# EAGLE schematic 4-Fach-Anzeige (EAGLE 7.2.0)
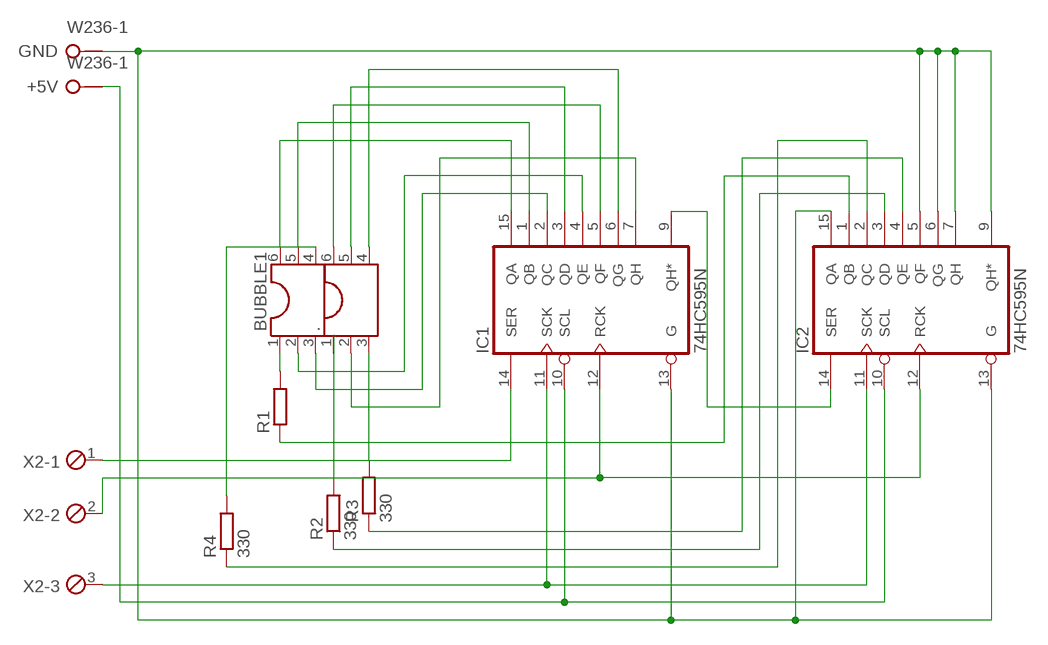
[diagram p0: schematic, sheet 1]

## Parts
+5V  W236-1  [W236-1]
.  DIL6  [DIL06]
BUBBLE1  DIL6  [DIL06]
GND  W236-1  [W236-1]
IC1  74HC595N  [DIL16]
IC2  74HC595N  [DIL16]
R1  R-EU_0207/10  [0207/10]
R2  330  R-EU_0207/10  [0207/10]
R3  330  R-EU_0207/10  [0207/10]
R4  330  R-EU_0207/10  [0207/10]
X2  MPT3  [3POL254]

## Nets
N$1: BUBBLE1.1 R1.2
N$2: ..3 R3.2
N$3: BUBBLE1.4 R4.2
N$4: BUBBLE1.2 IC1.4(QE)
N$5: BUBBLE1.3 IC1.2(QC)
N$6: ..2 IC1.7(QH)
N$7: R2.2
N$8: BUBBLE1.6 IC1.15(QA)
N$9: BUBBLE1.5 IC1.1(QB)
N$10: ..6 IC1.5(QF)
N$11: ..5 IC1.3(QD)
N$12: ..4 IC1.6(QG)
N$13: IC2.1(QB) R1.1
N$14: IC2.3(QD) R2.1
N$15: IC2.4(QE) R3.1
N$16: IC2.2(QC) R4.1
N$17: IC1.9(QH*) IC2.14(SER)
N$18: IC1.14(SER) X2.1
N$19: IC1.11(SCK) IC2.11(SCK) X2.3
N$20: IC1.12(RCK) IC2.12(RCK) X2.2
N$21: +5V.1(KL1) IC1.10(SCL) IC2.10(SCL)
N$24: GND.1(KL1) IC1.13(G) IC2.5(QF) IC2.6(QG) IC2.7(QH) IC2.9(QH*) IC2.13(G) IC2.15(QA)
Unconnected: +5V.2(KL2) ..1 GND.2(KL2)

## Power pins joined to a net without a drawn wire
GND: IC1.8(GND) IC2.8(GND)
VCC: IC1.16(VCC) IC2.16(VCC)

## Library data of the parts
+5V GND = con-wago-508:W236-1: WAGO SREW CLAMP; OC_FARNELL: unknown; OC_NEWARK: unknown
. BUBBLE1 = ic-package:DIL6: Dual In Line / Socket
IC1 IC2 = 74xx-eu:74*595: 8-bit SHIFT REGISTER, output latch
R1-R4 = resistor:R-EU_: RESISTOR, European symbol
X2 = con-phoenix-254:MPT3: PHOENIX CONNECTOR; OC_FARNELL: unknown; OC_NEWARK: unknown